# EAGLE design psu (EAGLE 5.11)
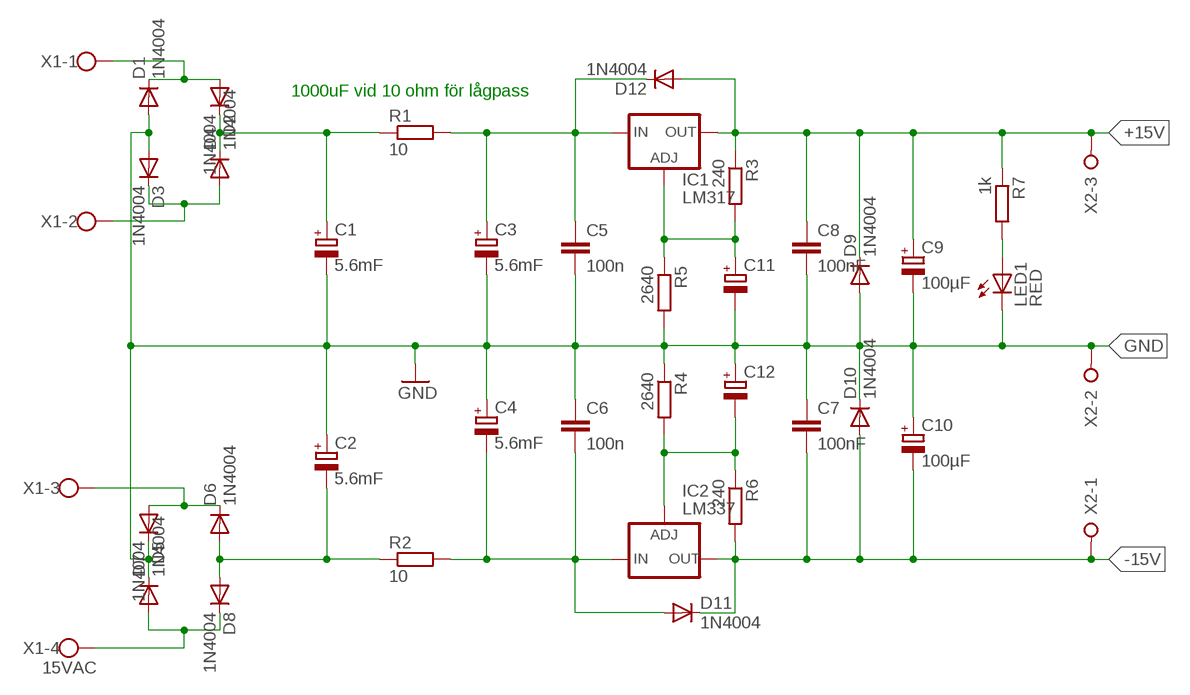
[diagram p0: schematic, sheet 1]

## Parts
C1  5.6mF  CPOL-EUE10-25  [EB25D]
C2  5.6mF  CPOL-EUE10-25  [EB25D]
C3  5.6mF  CPOL-EUE10-25  [EB25D]
C4  5.6mF  CPOL-EUE10-25  [EB25D]
C5  100n  C-EU050-030X075  [C050-030X075]
C6  100n  C-EU050-030X075  [C050-030X075]
C7  100nF  C-EU050-030X075  [C050-030X075]
C8  100nF  C-EU050-030X075  [C050-030X075]
C9  100µF  CPOL-EUE5-6  [E5-6]
C10  100µF  CPOL-EUE5-6  [E5-6]
C11  CPOL-EUE1.8-4  [E1,8-4]
C12  CPOL-EUE1.8-4  [E1,8-4]
D1  1N4004  [DO41-10]
D2  1N4004  [DO41-10]
D3  1N4004  [DO41-10]
D4  1N4004  [DO41-10]
D5  1N4004  [DO41-10]
D6  1N4004  [DO41-10]
D7  1N4004  [DO41-10]
D8  1N4004  [DO41-10]
D9  1N4004  [DO41-10]
D10  1N4004  [DO41-10]
D11  1N4004  [DO41-10]
D12  1N4004  [DO41-10]
IC1  LM317  LM317TS  [317TS]
IC2  LM337  LM337TS  [337TS]
LED1  RED  LED3MM  [LED3MM]
R1  10  R-EU_0617/22  [0617/22]
R2  10  R-EU_0617/22  [0617/22]
R3  240  R-EU_0207/10  [0207/10]
R4  2640  R-EU_0207/10  [0207/10]
R5  2640  R-EU_0207/10  [0207/10]
R6  240  R-EU_0207/10  [0207/10]
R7  1k  R-EU_0207/10  [0207/10]
X1  15VAC  W237-4  [W237-4]
X2  W237-03P  [W237-133]

## Nets
+15V: C8.1 C9.+ D9.C D12.A IC1.2(OUT) R3.1 R7.1 X2.3
-15V: C7.2 C10.- D10.A D11.C IC2.3(OUT) R6.2 X2.1
GND: C1.- C2.+ C3.- C4.+ C5.2 C6.1 C7.1 C8.2 C9.- C10.+ C11.- C12.+ D1.A D3.A D5.C D7.C D9.A D10.C LED1.K(C) R4.1 R5.2 X2.2
N$1: C11.+ IC1.1(ADJ) R3.2 R5.1
N$2: C3.+ C5.1 D12.C IC1.3(IN) R1.2
N$3: D5.A D6.C X1.3
N$4: D3.C D4.A X1.2
N$5: C4.- C6.2 D11.A IC2.2(IN) R2.2
N$6: D7.A D8.C X1.4
N$7: LED1.A R7.2
N$8: C12.- IC2.1(ADJ) R4.2 R6.1
N$12: C1.+ D2.C D4.C R1.1
N$14: D1.C D2.A X1.1
N$15: C2.- D6.A D8.A R2.1

## Notes on the sheet
- 1000uF vid 10 ohm för lågpass

## Library data of the parts
C1-C4 C9-C12 = rcl:CPOL-EU: POLARIZED CAPACITOR, European symbol
C5-C8 = rcl:C-EU: CAPACITOR, European symbol
D1-D12 = diode:1N4004: DIODE general purpose rectifier, 1 A
IC1 = v-reg:LM317TS: VOLTAGE REGULATOR
IC2 = v-reg:LM337TS: VOLTAGE REGULATOR
LED1 = led:LED: LED OSRAM: - CHIPLED LG R971, LG N971, LY N971, LG Q971, LY Q971, LO R971, LY R971 LH N974, LH R974 LS Q976, LO Q976, LY Q976 LO Q996 - Hyper CHIPLED LW Q18S LB Q993, LB Q99A, LB R99A - SideLED LS A670, LO A670, LY A670, LG A670, LP A670 LB A673, LV A673, LT A673, LW A673 LH A674 LY A675 LS A676, LA A676, LO A676, LY A676, LW A676 LS A679, LY A679, LG A679 - Hyper Micro SIDELED® LS Y876, LA Y876, LO Y876, LY Y876 LT Y87S - SmartLED LW L88C, LW L88S LB L89C, LB L89S, LG L890 LS L89K, LO L89K, LY L89K LS L896, LA L896, LO L896, LY L896 - TOPLED LS T670, LO T670, LY T670, LG T670, LP T670 LSG T670, LSP T670, LSY T670, LOP T670, LYG T670 LG T671, LOG T671, LSG T671 LB T673, LV T673, LT T673, LW T673 LH T674 LS T676, LA T676, LO T676, LY T676, LB T676, LH T676, LSB T676, LW T676 LB T67C, LV T67C, LT T67C, LS T67K, LO T67K, LY T67K, LW E67C LS E67B, LA E67B, LO E67B, LY E67B, LB E67C, LV E67C, LT E67C LW T67C LS T679, LY T679, LG T679 LS T770, LO T770, LY T770, LG T770, LP T770 LB T773, LV T773, LT T773, LW T773 LH T774 LS E675, LA E675, LY E675, LS T675 LS T776, LA T776, LO T776, LY T776, LB T776 LHGB T686 LT T68C, LB T68C - Hyper Mini TOPLED® LB M676 - Mini TOPLED Santana® LG M470 LS M47K, LO M47K, LY M47K Source: http://www.osram.convergy.de LUXEON: - LUMILED® LXK2-PW12-R00, LXK2-PW12-S00, LXK2-PW14-U00, LXK2-PW14-V00 LXK2-PM12-R00, LXK2-PM12-S00, LXK2-PM14-U00 LXK2-PE12-Q00, LXK2-PE12-R00, LXK2-PE12-S00, LXK2-PE14-T00, LXK2-PE14-U00 LXK2-PB12-K00, LXK2-PB12-L00, LXK2-PB12-M00, LXK2-PB14-N00, LXK2-PB14-P00, LXK2-PB14-Q00 LXK2-PR12-L00, LXK2-PR12-M00, LXK2-PR14-Q00, LXK2-PR14-R00 LXK2-PD12-Q00, LXK2-PD12-R00, LXK2-PD12-S00 LXK2-PH12-R00, LXK2-PH12-S00 LXK2-PL12-P00, LXK2-PL12-Q00, LXK2-PL12-R00 Source: www.luxeon.com KINGBRIGHT: KA-3528ASYC Source: www.kingbright.com
R1-R7 = rcl:R-EU_: RESISTOR, European symbol
X1 = con-wago-500:W237-4: WAGO SCREW CLAMP; OC_FARNELL: unknown; OC_NEWARK: unknown
X2 = con-wago-508:W237-03P: WAGO SREW CLAMP; OC_FARNELL: unknown; OC_NEWARK: unknown

## Board
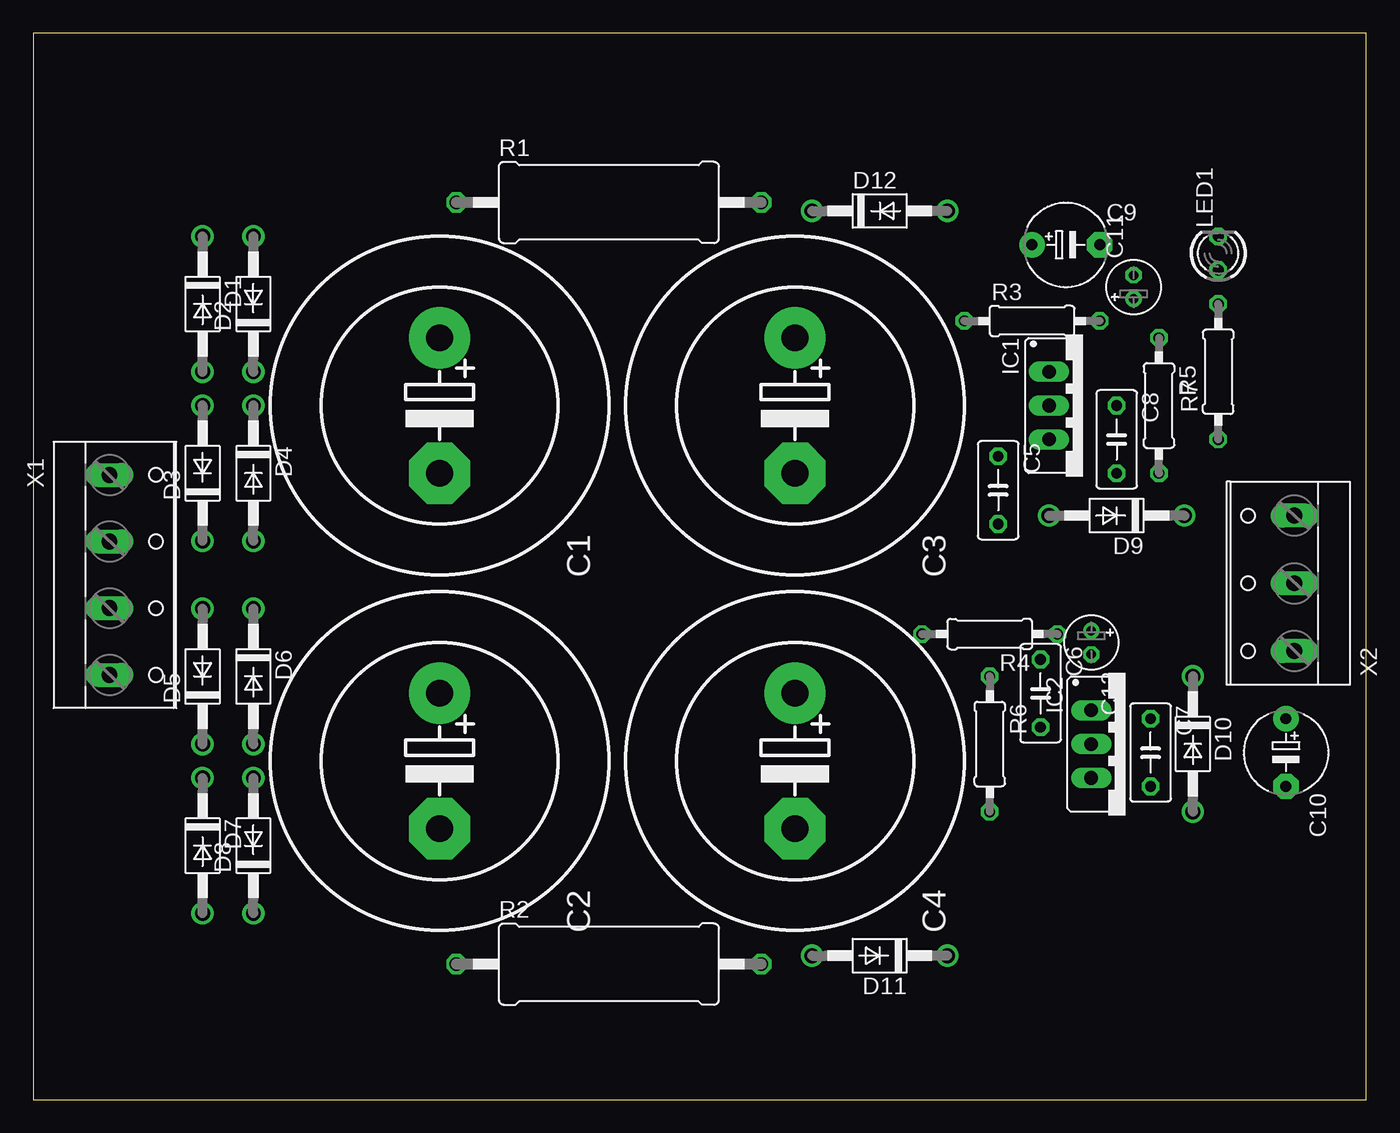
[diagram p1: board, top side]
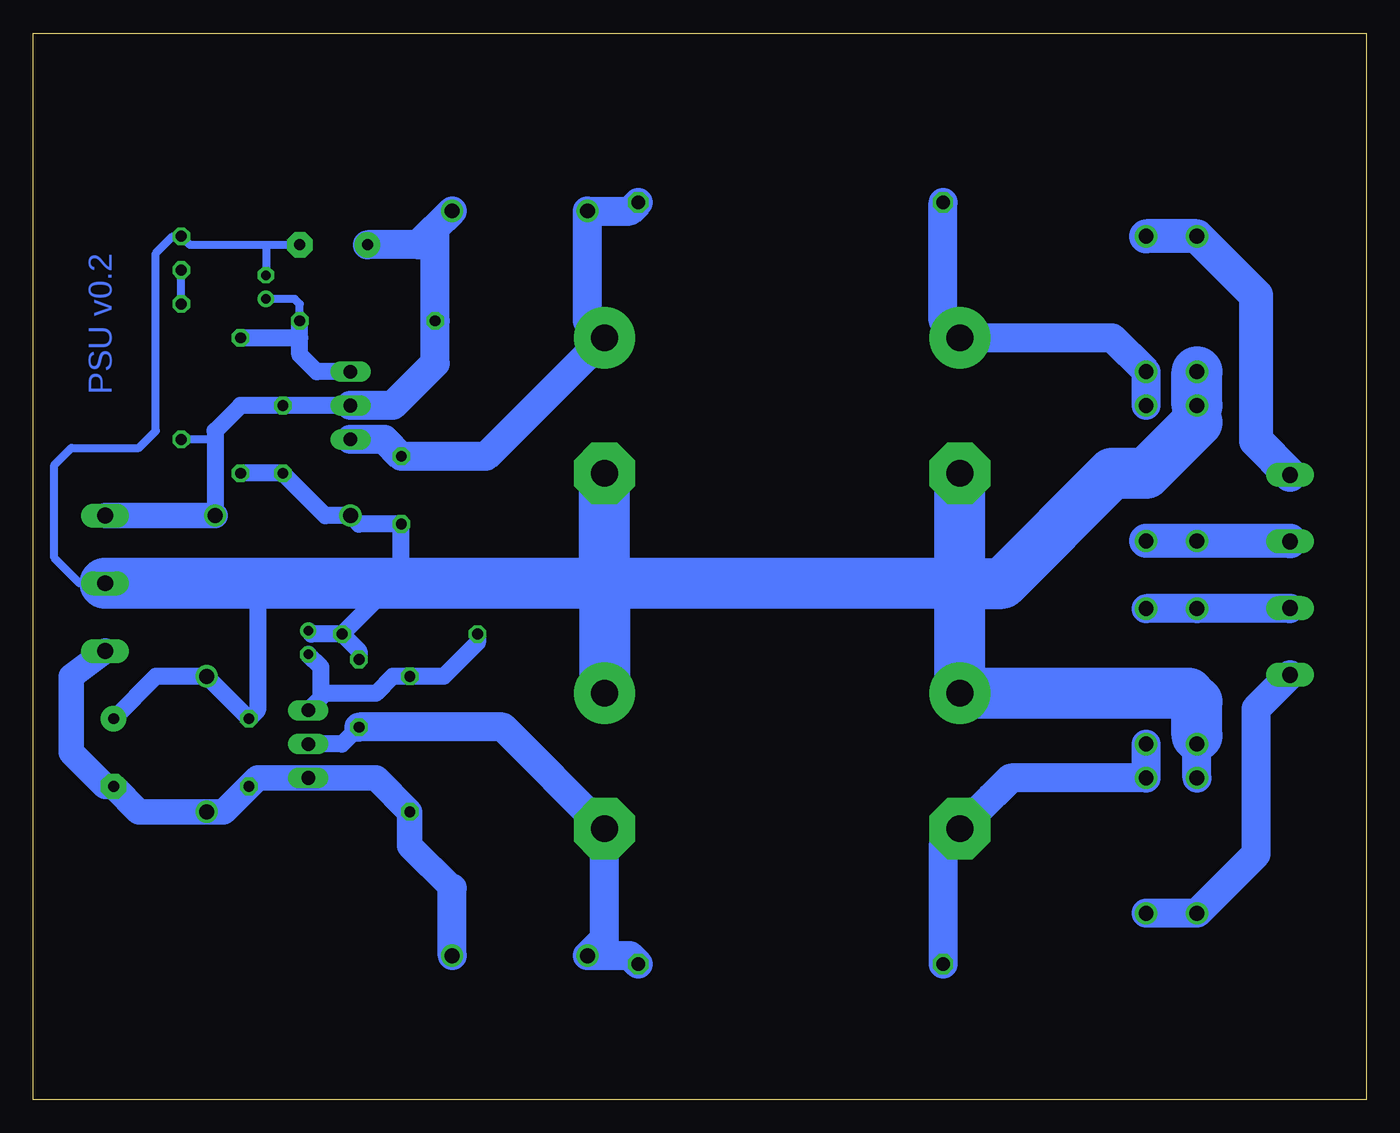
[diagram p2: board, bottom side, seen from below]

Size 100 x 80 mm. Coordinates in mm from the lower left corner, seen from the top.
Outline: 0,0 100,0 100,80 0,80 0,0
Copper layers (1*16): Top 0.035mm / dielectric 1.5mm / Bottom 0.035mm
Design rules "default": minimum track width 10mil, minimum drill 24mil, track to track 8mil, track to pad 8mil, pad to pad 8mil, via to via 8mil, smd to smd 8mil, copper to edge 40mil, drill to drill 8mil, minimum pad ring 10mil, minimum via ring 8mil, stop-mask expansion 4mil, vias tented up to drill 0mil, thermal gap 10mil

### Footprints (pad centres in the part's own frame; a part is rotated, then mirrored left to right if it is on the bottom)
EB25D = drill 2.007 pad 4.597 round: + -5.08,0 | drill 2.007 pad 4.597 octagon: - 5.08,0
C050-030X075 = drill 0.813 octagon: 1 -2.54,0; 2 2.54,0
E5-6 = drill 0.813 pad 1.905 round: + -2.54,0 | drill 0.813 pad 1.905 octagon: - 2.54,0
E1,8-4 = drill 0.711 pad 1.168 round: + -0.889,0 | drill 0.711 pad 1.168 octagon: - 0.889,0
DO41-10 = drill 1.118 round: A 5.08,0; C -5.08,0
317TS = drill 1.016 long: 1 -2.54,-2.54; 2 0,-2.54; 3 2.54,-2.54
337TS = drill 1.016 long: 1 -2.54,-2.54; 2 0,-2.54; 3 2.54,-2.54
LED3MM = drill 0.813 octagon: A -1.27,0; K 1.27,0
0617/22 = drill 1.016 octagon: 1 -11.43,0; 2 11.43,0
0207/10 = drill 0.813 octagon: 1 -5.08,0; 2 5.08,0
W237-4 = drill 1.194 long: 1 -7.5,-1.27; 2 -2.5,-1.27; 3 2.5,-1.27; 4 7.5,-1.27
W237-133 = drill 1.194 long: 1 -5.08,-0.635; 2 0,-0.635; 3 5.08,-0.635

### Placement (x,y rotation side)
C1  30.48,52.07 270 top
C2  30.48,25.4 270 top
C3  57.15,52.07 270 top
C4  57.15,25.4 270 top
C5  72.39,45.72 270 top
C6  75.56,30.48 270 top
C7  83.82,26.04 270 top
C8  81.28,49.53 270 top
C9  77.47,64.14 0 top
C10  93.98,26.04 270 top
C11  82.55,60.96 90 top
C12  79.38,34.29 270 top
D1  12.7,59.69 270 top
D2  16.51,59.69 90 top
D3  12.7,46.99 90 top
D4  16.51,46.99 270 top
D5  12.7,31.75 90 top
D6  16.51,31.75 270 top
D7  12.7,19.05 270 top
D8  16.51,19.05 90 top
D9  81.28,43.81 180 top
D10  87,26.67 270 top
D11  63.5,10.79 180 top
D12  63.5,66.67 0 top
IC1  78.74,52.07 270 top
IC2  81.92,26.67 270 top
LED1  88.9,63.5 90 top
R1  43.18,67.31 0 top
R2  43.18,10.16 0 top
R3  74.93,58.42 0 top
R4  71.75,34.92 180 top
R5  84.45,52.07 270 top
R6  71.75,26.67 270 top
R7  88.9,54.61 90 top
X1  6.99,39.37 270 top
X2  93.98,38.73 90 top

### Tracks (layer width: path | path; a pad name or v marks a point on that pad's centre or on a via)
+15V
  Bottom 0.61: 86.36,49.53 R7.1
  Bottom 1.27: IC1.2 C8.1 84.45,52.07 86.36,50.16 86.36,49.53 D9.C
  Bottom 1.93: D9.C X2.3
  Bottom 2.184: C9.+ 71.12,64.14 D12.A 69.85,65.41 R3.1 69.85,55.24 73.03,52.07 IC1.2
-15V
  Bottom 1.93: 68.58,15.88 71.75,19.05 R6.2 74.3,24.13 IC2.3 83.19,24.13 C7.2 85.72,21.59 D10.A 92.08,21.59 C10.- 94.61,23.5 97.16,26.04 97.16,31.75 X2.1
  Bottom 2.184: D11.C 68.58,15.88
GND
  Bottom 0.61: X2.2 96.52,38.73 98.42,40.64 98.42,47.62 97.16,48.9 92.08,48.9 90.81,50.16 90.81,63.5 89.53,64.77 LED1.K 88.27,64.14 82.55,64.14 | 82.55,64.14 C9.- | 82.55,64.14 C11.-
  Bottom 1.27: R5.2 C8.2 78.11,43.81 D9.A 75.56,43.18 C5.2 72.39,39.37 73.03,38.73 R4.1 | C12.+ 79.12,34.92 R4.1 | R4.1 75.56,33.66 C6.1 | 83.19,38.73 83.19,29.21 C7.1 D10.C 90.81,31.75 C10.+
  Bottom 1.778: D7.C 12.7,27.3
  Bottom 2.184: D7.C D5.C
  Bottom 2.54: 12.7,50.8 D3.A
  Bottom 3.81: 57.15,38.73 73.03,38.73 83.19,38.73 X2.2 | 57.15,38.73 C3.- | 57.15,38.73 C4.+ | 12.7,50.8 16.51,46.99 19.05,46.99 27.3,38.73 30.48,38.73 | D3.A D1.A | 30.48,38.73 57.15,38.73 | 30.48,38.73 C1.- | 30.48,38.73 C2.+ 13.34,30.48 12.7,29.84 12.7,27.3
N$1
  Bottom 0.61: R3.2 80.01,59.69 80.39,60.07 C11.+
  Bottom 1.27: IC1.1 78.74,54.61 80.01,55.88 80.01,57.15 | 80.01,57.15 R3.2 | 80.01,57.15 R5.1
N$2
  Bottom 2.184: R1.2 55.24,66.67 D12.C 58.42,58.42 C3.+ 66.04,48.26 C5.1 73.66,49.53 IC1.3
N$3
  Bottom 2.184: D6.C D5.A 5.75,36.83 X1.3
N$4
  Bottom 2.54: X1.2 5.71,41.91 D3.C D4.A
N$5
  Bottom 1.27: C6.2 76.83,26.67 IC2.2
  Bottom 2.184: C6.2 64.77,27.94 C4.- 57.15,12.06 D11.A 55.24,10.79 R2.2
N$6
  Bottom 2.184: D8.C D7.A 8.26,18.41 8.26,29.33 X1.4
N$7
  Bottom 0.61: R7.2 LED1.A
N$8
  Bottom 1.27: 78.42,30.16 78.11,30.48 74.3,30.48 73.03,31.75 R6.1 69.22,31.75 66.67,34.29 R4.2 | 78.42,30.16 IC2.1 | C12.- 78.42,32.45 78.42,30.16
N$12
  Bottom 2.184: D4.C D2.C 19.05,57.15 C1.+ 31.75,58.42 R1.1
N$14
  Bottom 2.54: X1.1 8.26,49.41 8.26,60.33 D1.C D2.A
N$15
  Bottom 2.184: R2.1 31.75,19.05 C2.- 28.26,22.54 27.94,22.86 26.67,24.13 D8.A D6.A

### Text on the board
Bottom: PSU v0.2